# EAGLE schematic Nerf Driver (EAGLE 8.7.0)
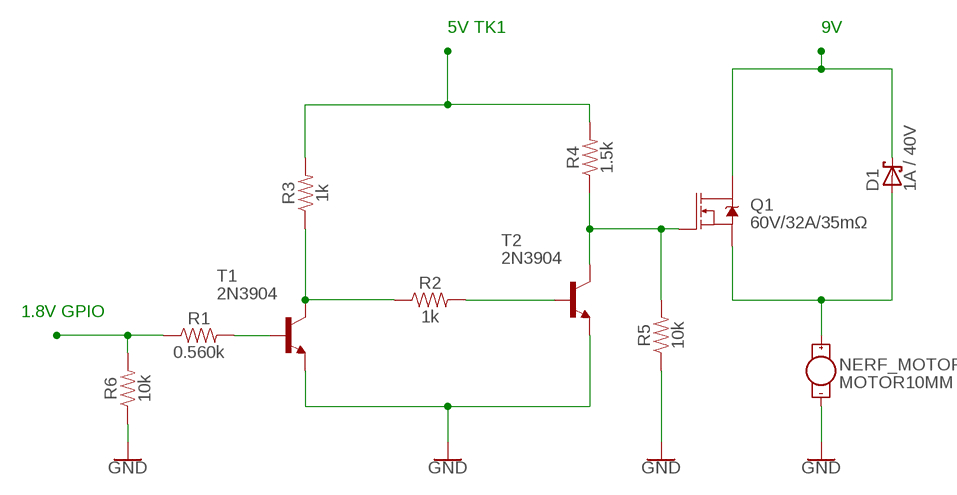
[diagram p0: schematic, sheet 1]

## Parts
D1  1A / 40V  SCHOTTKY-DIODECB429-17  [CB429-17]
NERF_MOTOR  MOTOR10MM  [VIBE-MOTOR-10MM]
Q1  60V/32A/35mΩ  MOSFET-NCH-FQP30N06L  [TO220V]
R1  0.560k  1KOHM-HORIZ-1/4W-5%  [AXIAL-0.3]
R2  1k  1KOHM-HORIZ-1/4W-5%  [AXIAL-0.3]
R3  1k  1KOHM-HORIZ-1/4W-5%  [AXIAL-0.3]
R4  1.5k  1KOHM-HORIZ-1/4W-5%  [AXIAL-0.3]
R5  10k  1KOHM-HORIZ-1/4W-5%  [AXIAL-0.3]
R6  10k  1KOHM-HORIZ-1/4W-5%  [AXIAL-0.3]
T1  2N3904  [TO92]
T2  2N3904  [TO92]

## Nets
GND: NERF_MOTOR.- R5.P$1 R6.P$1 T1.3(E) T2.3(E)
N$1: R1.P$2 T1.2(B)
N$2: R2.P$1 R3.P$1 T1.1(C)
N$3: R2.P$2 T2.2(B)
N$4: D1.C Q1.2(D)
N$5: Q1.1(G) R4.P$1 R5.P$2 T2.1(C)
N$6: R3.P$2 R4.P$2
N$7: R1.P$1 R6.P$2
N$8: D1.A NERF_MOTOR.+ Q1.3(S)

## Notes on the sheet
- 5V TK1 | 9V
- 1.8V GPIO

## Library data of the parts
D1 = diode:SCHOTTKY-DIODE: Schottky Diode
NERF_MOTOR = SparkFun-Electromechanical:MOTOR: Motor (Single-Phase) Two-terminal, single-phase motors. SparkFun Products Vibration Motor <https://www.sparkfun.com/products/8449> (ROB-08449) Physical dimension and wire connections for this powerful vibration motor. Motor has a self adhesive backing.; PROD_ID: COMP-08572; SF_SKU: ROB-08449
Q1 = SparkFun-DiscreteSemi:MOSFET-NCH: N-channel MOSFETs Voltage controlled devices that allow control of high current outputs. SparkFun Products: SparkFun OpenScale <https://www.sparkfun.com/products/13261> SparkFun Digital Sandbox <https://www.sparkfun.com/products/12651> SparkFun Monster Moto Shield <https://www.sparkfun.com/products/10182> SparkFun MOSFET Power Controller <https://www.sparkfun.com/products/11214>; PROD_ID: TRANS-10060
R1 R4-R6 = SparkFun-Resistors:1KOHM: 1kΩ resistor A resistor is a passive two-terminal electrical component that implements electrical resistance as a circuit element. Resistors act to reduce current flow, and, at the same time, act to lower voltage levels within circuits. - Wikipedia; PROD_ID: RES-08380; VALUE: 1k
R2 R3 = SparkFun-Resistors:1KOHM: 1kΩ resistor A resistor is a passive two-terminal electrical component that implements electrical resistance as a circuit element. Resistors act to reduce current flow, and, at the same time, act to lower voltage levels within circuits. - Wikipedia; PROD_ID: RES-08380
T1 T2 = transistor:2N3904: NPN TRANSISTOR